# Altium schematic sheet A05_ENCODER_NTC.SchDoc: A05_ENCODER_NTC
size 420 x 296 mm; Revision: A-SCH-AD-R2-NO-TP; SheetNumber: 5; SheetTotal: 7
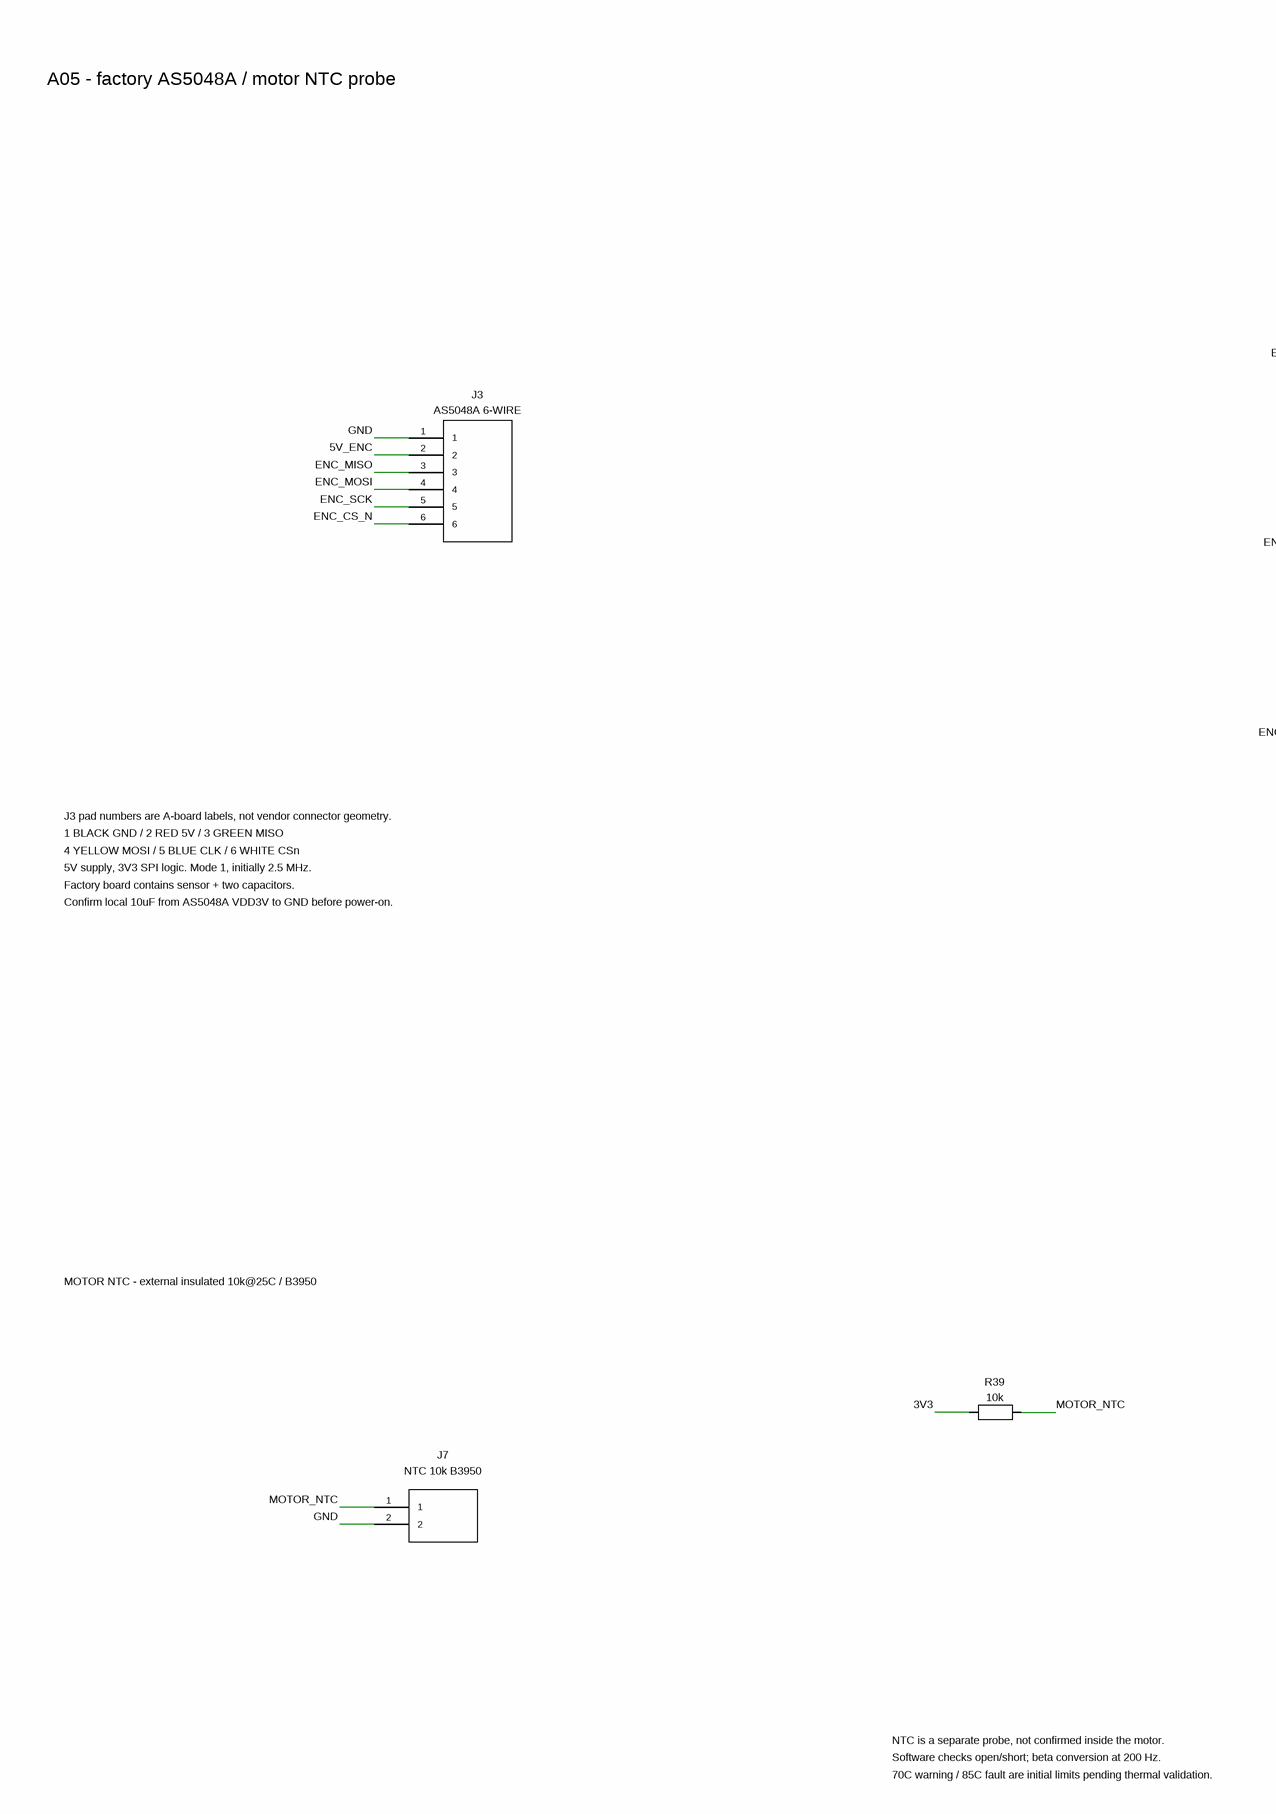
[diagram p0: A05_ENCODER_NTC.SchDoc, left]
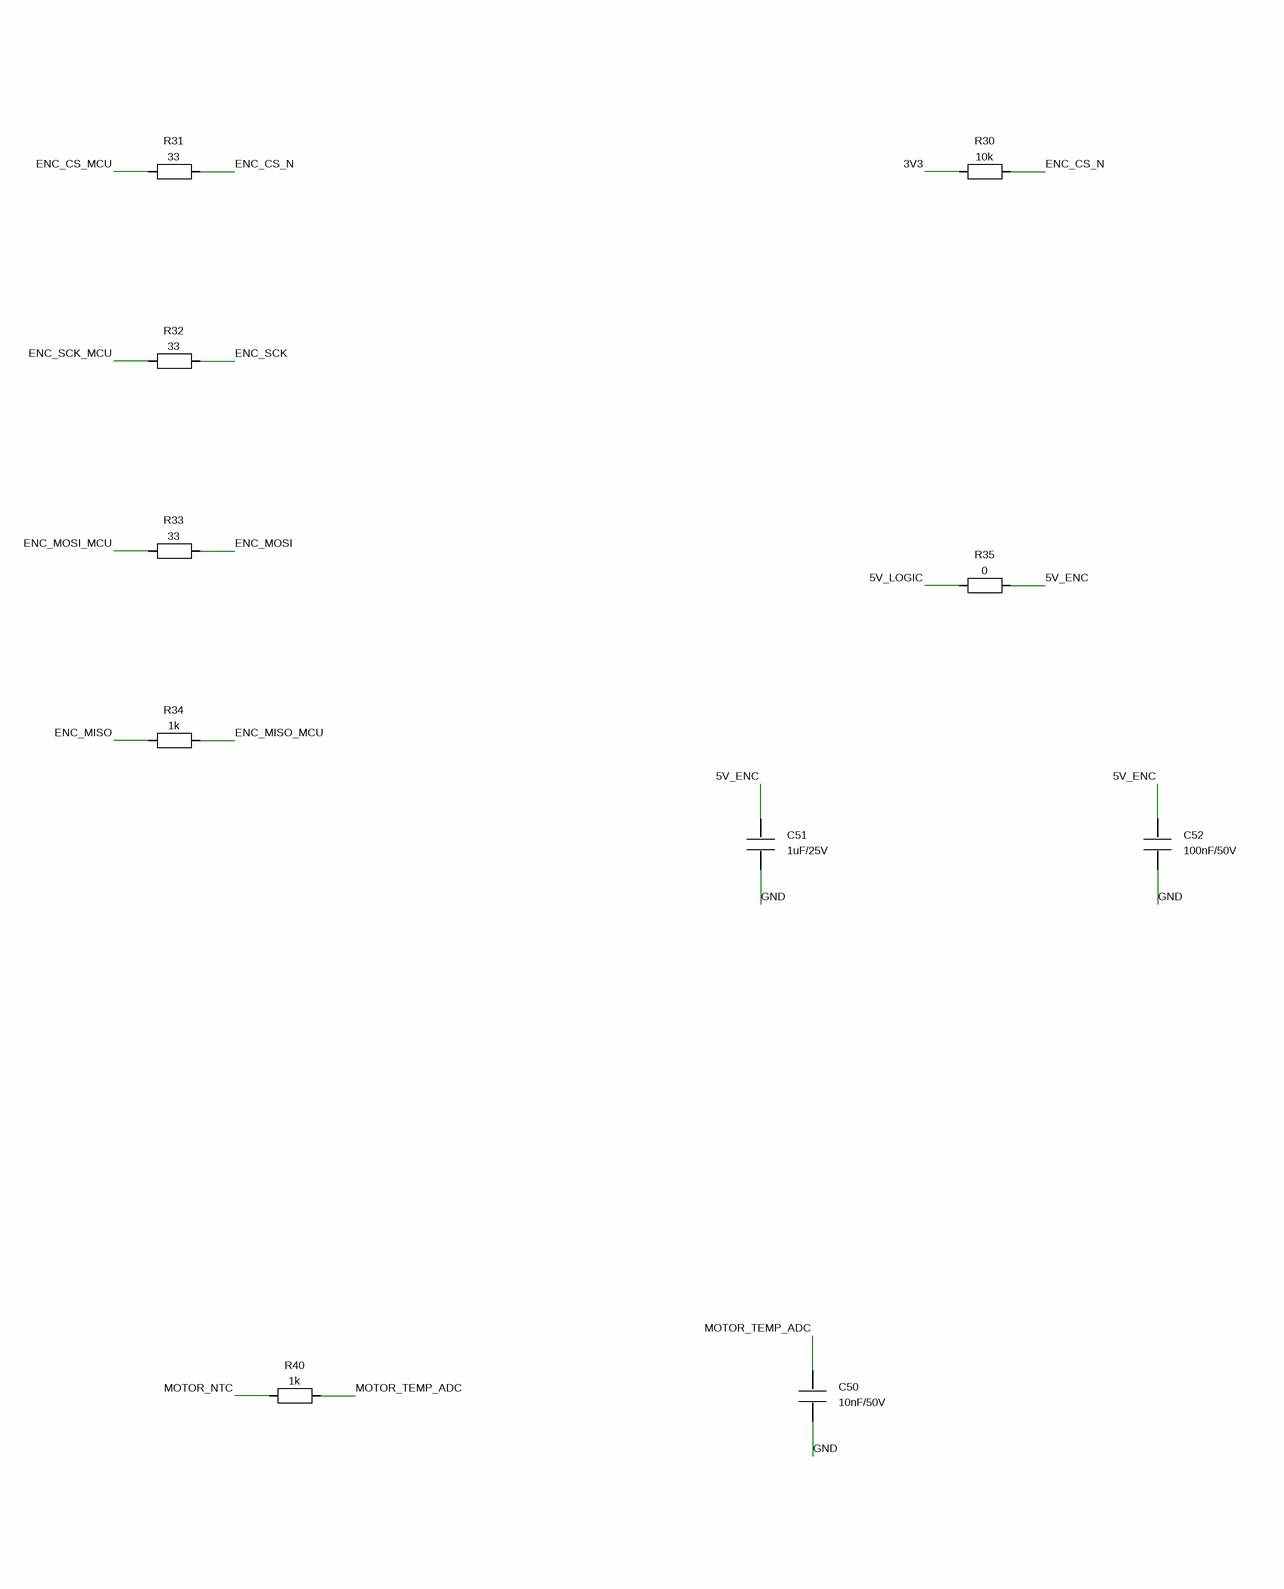
[diagram p1: A05_ENCODER_NTC.SchDoc, right]

## Parts
C50  10nF/50V  [C0603_M]
C51  1uF/25V  [C0603_M]
C52  100nF/50V  [C0603_M]
J3  AS5048A 6-WIRE
J7  NTC 10k B3950  [GL30_B2B_PH_K_S_FR4_D085]
R30  10k  [R0603_M]
R31  33  [R0603_M]
R32  33  [R0603_M]
R33  33  [R0603_M]
R34  1k  [R0603_M]
R35  0  [R0603_M]
R39  10k  [R0603_M]
R40  1k  [R0603_M]

## Nets
3V3: R30.1 R39.1
5V_ENC: C51.1 C52.1 J3.2 R35.2
5V_LOGIC: R35.1
ENC_CS_MCU: R31.1
ENC_CS_N: J3.6 R30.2 R31.2
ENC_MISO: J3.3 R34.1
ENC_MISO_MCU: R34.2
ENC_MOSI: J3.4 R33.2
ENC_MOSI_MCU: R33.1
ENC_SCK: J3.5 R32.2
ENC_SCK_MCU: R32.1
GND: C50.2 C51.2 C52.2 J3.1 J7.2
MOTOR_NTC: J7.1 R39.2 R40.1
MOTOR_TEMP_ADC: C50.1 R40.2

## Notes on the sheet
- A05 - factory AS5048A / motor NTC probe
- J3 pad numbers are A-board labels, not vendor connector geometry.
- 1 BLACK GND / 2 RED 5V / 3 GREEN MISO
- 4 YELLOW MOSI / 5 BLUE CLK / 6 WHITE CSn
- 5V supply, 3V3 SPI logic. Mode 1, initially 2.5 MHz.
- Factory board contains sensor + two capacitors.
- Confirm local 10uF from AS5048A VDD3V to GND before power-on.
- MOTOR NTC - external insulated 10k@25C / B3950
- NTC is a separate probe, not confirmed inside the motor.
- Software checks open/short; beta conversion at 200 Hz.
- 70C warning / 85C fault are initial limits pending thermal validation.

## Library data of the parts
C50 = C: 电容; MPN: CC0603KRX7R9BB103; Source_KiCad_Footprint: GL30:C_0603_1608Metric; Specification: 10 nF / 50 V X7R; Assembly: FITTED; PCB_Model_Status: USER_LIBRARY_LINKED_PIN_NUMBERS_CHECKED; Package: 0603; Footprint_status: LIBRARY_SELECTED_PENDING_LAYOUT_REVIEW; Value: 10nF/50V
C51 = C: 电容; MPN: CL10A105KA8NNNC; Source_KiCad_Footprint: GL30:C_0603_1608Metric; Specification: 1 µF / 25 V X5R; Assembly: FITTED; PCB_Model_Status: USER_LIBRARY_LINKED_PIN_NUMBERS_CHECKED; Package: 0603; Footprint_status: LIBRARY_SELECTED_PENDING_LAYOUT_REVIEW; Value: 1uF/25V
C52 = C: 电容; MPN: CL10B104KB8NNNC; Source_KiCad_Footprint: GL30:C_0603_1608Metric; Specification: 100 nF / 50 V X7R; Assembly: FITTED; PCB_Model_Status: USER_LIBRARY_LINKED_PIN_NUMBERS_CHECKED; Package: 0603; Footprint_status: LIBRARY_SELECTED_PENDING_LAYOUT_REVIEW; Value: 100nF/50V
J3 = Connector_6: AS5048A编码器焊线口; MPN: 6标号焊盘；不假定原厂插头脚号; Design_note: 编号为本板定义；颜色不能代表未知插头从左到右位置; Assembly: DNP_OR_DIRECT_WIRE_PADS; PCB_Model_Status: NOT_ASSIGNED_IN_ALTIUM_SCHEMATIC_DELIVERY; Package: 6焊盘低电流焊线区; Specification: 6标号焊盘；不假定原厂插头脚号; Footprint_status: PENDING_PHYSICAL_FOOTPRINT_REVIEW; Value: AS5048A 6-WIRE
J7 = Connector_2: 电机温度探头; MPN: JST B2B-PH-K-S(LF)(SN); Source_KiCad_Footprint: GL30:JST_PH_B2B-PH-K_1x02_P2.00mm_Vertical; Design_note: 本版采用10k/B3950无源NTC；必须与电池NTC分开; Assembly: FITTED; PCB_Model_Status: USER_LIBRARY_LINKED_PIN_NUMBERS_CHECKED; Package: PH 2.0mm 2P 直插; Specification: JST B2B-PH-K-S(LF)(SN); Footprint_status: LIBRARY_SELECTED_PENDING_LAYOUT_REVIEW; Value: NTC 10k B3950
R30 = R: 电阻; MPN: 通用厚膜 10k 1% 0.1 W; Source_KiCad_Footprint: GL30:R_0603_1608Metric; Specification: 10k Ω；1%；0.1 W; Assembly: FITTED; PCB_Model_Status: USER_LIBRARY_LINKED_PIN_NUMBERS_CHECKED; Package: 0603; Footprint_status: LIBRARY_SELECTED_PENDING_LAYOUT_REVIEW; Value: 10k
R31-R33 = R: 电阻; MPN: 通用厚膜 33 1% 0.1 W; Source_KiCad_Footprint: GL30:R_0603_1608Metric; Specification: 33 Ω；1%；0.1 W; Assembly: FITTED; PCB_Model_Status: USER_LIBRARY_LINKED_PIN_NUMBERS_CHECKED; Package: 0603; Footprint_status: LIBRARY_SELECTED_PENDING_LAYOUT_REVIEW; Value: 33
R34 = R: 电阻; MPN: 通用厚膜 1k 1% 0.1 W; Source_KiCad_Footprint: GL30:R_0603_1608Metric; Specification: 1k Ω；1%；0.1 W; Design_note: MISO接收端限流；2.5MHz实测边沿，不当作源端终端; Assembly: FITTED; PCB_Model_Status: USER_LIBRARY_LINKED_PIN_NUMBERS_CHECKED; Package: 0603; Footprint_status: LIBRARY_SELECTED_PENDING_LAYOUT_REVIEW; Value: 1k
R35 = R: 电阻; MPN: 通用0Ω跳线 0.1 W; Source_KiCad_Footprint: GL30:R_0603_1608Metric; Specification: 0 Ω跳线；0.1 W; Design_note: 编码器电源支路可断开测流; Assembly: FITTED; PCB_Model_Status: USER_LIBRARY_LINKED_PIN_NUMBERS_CHECKED; Package: 0603; Footprint_status: LIBRARY_SELECTED_PENDING_LAYOUT_REVIEW; Value: 0
R39 = R: 电阻; MPN: 通用厚膜 10k 1% 0.1 W; Source_KiCad_Footprint: GL30:R_0603_1608Metric; Specification: 10k Ω；1%；0.1 W; Design_note: NTC上拉；NTC25℃=10k; Assembly: FITTED; PCB_Model_Status: USER_LIBRARY_LINKED_PIN_NUMBERS_CHECKED; Package: 0603; Footprint_status: LIBRARY_SELECTED_PENDING_LAYOUT_REVIEW; Value: 10k
R40 = R: 电阻; MPN: 通用厚膜 1k 1% 0.1 W; Source_KiCad_Footprint: GL30:R_0603_1608Metric; Specification: 1k Ω；1%；0.1 W; Assembly: FITTED; PCB_Model_Status: USER_LIBRARY_LINKED_PIN_NUMBERS_CHECKED; Package: 0603; Footprint_status: LIBRARY_SELECTED_PENDING_LAYOUT_REVIEW; Value: 1k